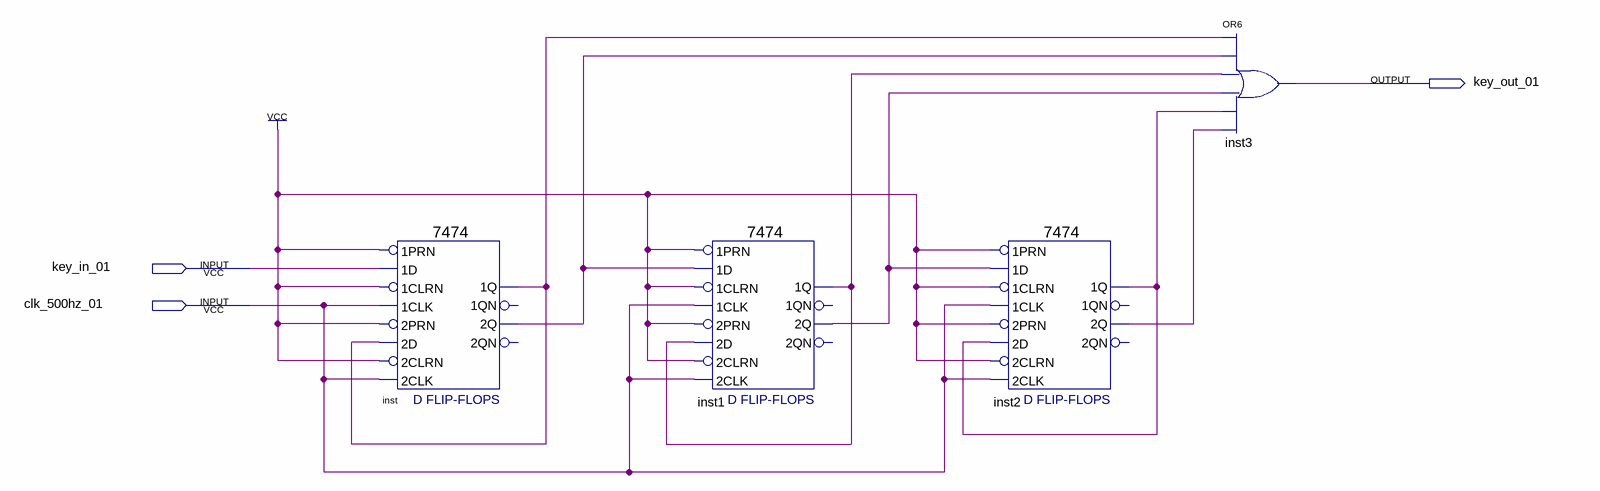
[diagram p0: schematic sheet]
// Quartus schematic dou.bdf as structural Verilog: 4 symbols, 3 pins
module dou (
  input  key_in_01,
  input  clk_500hz_01,
  output key_out_01
);

  wire inst1_1q, inst1_2q, inst2_1q, inst2_2q, inst_1q, inst_2q;

  \7474  inst (
    .\2D (inst_1q), .\2PRN (1'b1), .\1CLK (clk_500hz_01), .\1D (key_in_01), .\1PRN (1'b1),
    .\2CLK (clk_500hz_01), .\2CLRN (1'b1), .\1CLRN (1'b1), .\2Q (inst_2q), .\1Q (inst_1q));  // open: 1QN, 2QN
  \7474  inst1 (
    .\2D (inst1_1q), .\2PRN (1'b1), .\1CLK (clk_500hz_01), .\1D (inst_2q), .\1PRN (1'b1),
    .\2CLK (clk_500hz_01), .\2CLRN (1'b1), .\1CLRN (1'b1), .\2Q (inst1_2q), .\1Q (inst1_1q));  // open: 1QN, 2QN
  \7474  inst2 (
    .\2D (inst2_1q), .\2PRN (1'b1), .\1CLK (clk_500hz_01), .\1D (inst1_2q), .\1PRN (1'b1),
    .\2CLK (clk_500hz_01), .\2CLRN (1'b1), .\1CLRN (1'b1), .\2Q (inst2_2q), .\1Q (inst2_1q));  // open: 1QN, 2QN
  or inst3 (key_out_01, inst_1q, inst_2q, inst1_1q, inst1_2q, inst2_1q, inst2_2q);
endmodule
